# EAGLE schematic MJ818 clone - all driver - POC (EAGLE 9.4.0)
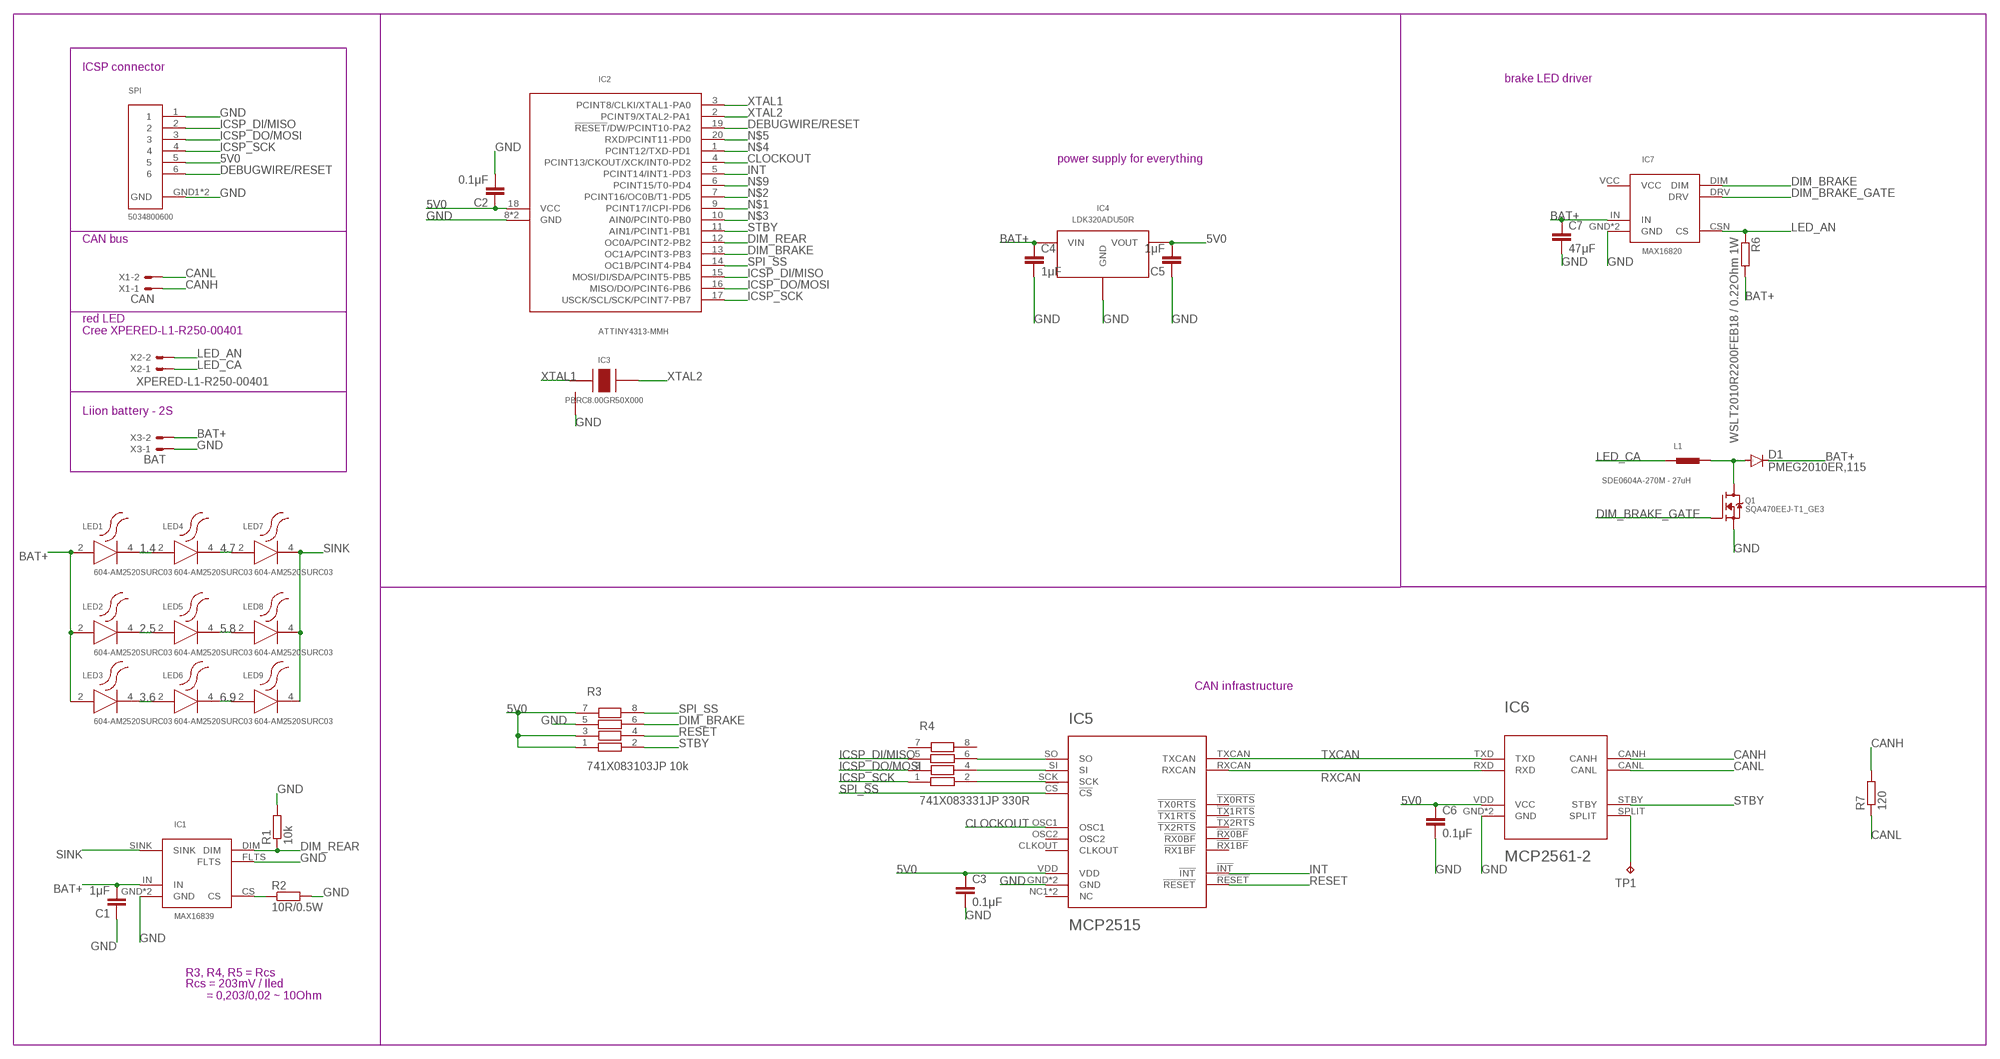
[diagram p0: schematic, sheet 1]

## Parts
C1  1μF  C-EUC0402  [C0402]
C2  0.1μF  C-EUC0402  [C0402]
C3  0.1μF  C-EUC0402  [C0402]
C4  1μF  C-EUC0402  [C0402]
C5  1μF  C-EUC0402  [C0402]
C6  0.1μF  C-EUC0402  [C0402]
C7  47μF  C-EUC0805  [C0805]
D1  PMEG2010ER,115  DIODE-SOD123  [SOD123]
IC1  MAX16839  MAX16839  [TDFN-6-EP]
IC2  ATTINY4313-MMH  ATTINY4313VQFN-20  [VQFN-20]
IC3  PBRC8.00GR50X000  PRQV  [SMT]
IC4  LDK320ADU50R  LDO  [SOT-89-D]
IC5  MCP2515  MCP2515-I-ML  [QFN20]
IC6  MCP2561-2  [DFN10]
IC7  MAX16820  [TDFN-6-EP]
L1  SDE0604A-270M - 27uH  DE0604A-778075  [SMT]
LED1  604-AM2520SURC03  1374-CLM2D-RCC-ACC-1064252  [SMD]
LED2  604-AM2520SURC03  1374-CLM2D-RCC-ACC-1064252  [SMD]
LED3  604-AM2520SURC03  1374-CLM2D-RCC-ACC-1064252  [SMD]
LED4  604-AM2520SURC03  1374-CLM2D-RCC-ACC-1064252  [SMD]
LED5  604-AM2520SURC03  1374-CLM2D-RCC-ACC-1064252  [SMD]
LED6  604-AM2520SURC03  1374-CLM2D-RCC-ACC-1064252  [SMD]
LED7  604-AM2520SURC03  1374-CLM2D-RCC-ACC-1064252  [SMD]
LED8  604-AM2520SURC03  1374-CLM2D-RCC-ACC-1064252  [SMD]
LED9  604-AM2520SURC03  1374-CLM2D-RCC-ACC-1064252  [SMD]
Q1  SQA470EEJ-T1_GE3  SIA456DJ  [SC-70-6]
R1  10k  R-EU_R0402  [R0402]
R2  10R/0.5W  R-EU_R0603  [R0603]
R3  741X083103JP 10k  741X083331JP  [0402]
R4  741X083331JP 330R  741X083331JP  [0402]
R6  WSLT2010R2200FEB18 / 0.22Ohm 1W  R-EU_R2010  [R2010]
R7  120  R-EU_R0805  [R0805]
SPI  5034800600  [SMT]
TP1  TPB2,54  [B2,54]
X1  CAN  22-23-2021  [22-23-2021]
X2  XPERED-L1-R250-00401  22-23-2021  [22-23-2021]
X3  BAT  22-23-2021  [22-23-2021]

## Nets
1.4: LED1.4(C) LED4.2(A)
2.5: LED2.4(C) LED5.2(A)
3.6: LED3.4(C) LED6.2(A)
4.7: LED4.4(C) LED7.2(A)
5.8: LED5.4(C) LED8.2(A)
5V0 [5V0CAN]: C2.1 C3.1 C5.2 C6.1 IC2.18(VCC) IC4.VOUT IC5.VDD IC6.VDD(VCC) R3.1 R3.3 R3.7 SPI.5
6.9: LED6.4(C) LED9.2(A)
BAT+ [currett-0.45]: C1.2 C4.1 C7.1 D1.C IC1.IN IC4.VIN IC7.IN LED1.2(A) LED2.2(A) LED3.2(A) R6.2 X3.2
CANH [signal]: IC6.CANH R7.2 X1.1
CANL [signal]: IC6.CANL R7.1 X1.2
CLOCKOUT [signal]: IC2.4(PCINT13/CKOUT/XCK/INT0-PD2) IC5.OSC1
CS: IC1.CS R2.1
DEBUGWIRE/RESET [signal]: IC2.19(!RESET!/DW/PCINT10-PA2) SPI.6
DIM_BRAKE [signal]: IC2.13(OC1A/PCINT3-PB3) IC7.DIM R3.6
DIM_BRAKE_DRAIN: D1.A L1.P$2 Q1.D
DIM_BRAKE_GATE [signal]: IC7.DRV Q1.G
DIM_REAR [signal]: IC1.DIM IC2.12(OC0A/PCINT2-PB2) R1.1
GND: C1.1 C2.2 C3.2 C4.2 C5.1 C6.2 C7.2 IC1.FLTS IC1.GND IC1.GND1(GND) IC2.8(GND) IC2.GND IC3.GND IC4.GND IC5.GND IC5.GND6(GND) IC6.GND IC6.VSS(GND) IC7.GND IC7.GND1(GND) Q1.S R1.2 R2.2 R3.5 SPI.1 SPI.GND1(GND) SPI.GND2(GND) X3.1
ICSP_DI/MISO [signal]: IC2.15(MOSI/DI/SDA/PCINT5-PB5) R4.5 SPI.2
ICSP_DO/MOSI [signal]: IC2.16(MISO/DO/PCINT6-PB6) R4.3 SPI.3
ICSP_SCK [signal]: IC2.17(USCK/SCL/SCK/PCINT7-PB7) R4.1 SPI.4
INT [signal]: IC2.5(PCINT14/INT1-PD3) IC5.!INT!
LED_AN [currett-0.45]: IC7.CSN(CS) R6.1 X2.2
LED_CA: L1.P$1 X2.1
N$1: IC2.9(PCINT17/ICPI-PD6)
N$2: IC2.7(PCINT16/OC0B/T1-PD5)
N$3: IC2.10(AIN0/PCINT0-PB0)
N$4: IC2.1(PCINT12/TXD-PD1)
N$5: IC2.20(RXD/PCINT11-PD0)
N$9: IC2.6(PCINT15/T0-PD4)
RESET [signal]: IC5.!RESET! R3.4
RXCAN [signal]: IC5.RXCAN IC6.RXD
SINK: IC1.SINK LED7.4(C) LED8.4(C) LED9.4(C)
SPI_MISO [signal]: IC5.SO R4.6
SPI_MOSI [signal]: IC5.SI R4.4
SPI_SCK [signal]: IC5.SCK R4.2
SPI_SS [signal]: IC2.14(OC1B/PCINT4-PB4) IC5.!CS! R3.8
SPLIT: IC6.SPLIT TP1.TP
STBY [signal]: IC2.11(AIN1/PCINT1-PB1) IC6.STBY R3.2
TXCAN [signal]: IC5.TXCAN IC6.TXD
XTAL1 [signal]: IC2.3(PCINT8/CLKI/XTAL1-PA0) IC3.XTAL1
XTAL2 [signal]: IC2.2(PCINT9/XTAL2-PA1) IC3.XTAL2
Unconnected: IC5.!RX0BF! IC5.!RX1BF! IC5.!TX0RTS! IC5.!TX1RTS! IC5.!TX2RTS! IC5.CLKOUT IC5.NC1(NC) IC5.NC2(NC) IC5.OSC2 R4.7 R4.8

## Notes on the sheet
- ICSP connector
- brake LED driver
- power supply for everything
- CAN bus
- red LED
  Cree XPERED-L1-R250-00401
- Liion battery - 2S
- CAN infrastructure
- R3, R4, R5 = Rcs
- Rcs = 203mV / Iled
         = 0,203/0,02 ~ 10Ohm

## Power pins joined to a net without a drawn wire
VCC: IC7.VCC

## Library data of the parts
C1-C7 = rcl:C-EU: CAPACITOR, European symbol; SPICEPREFIX: C
D1 = diode:DIODE-: DIODE
IC1 = MAX16839 LED Driver, constant current:MAX16839
IC2 = ATtiny4313 microcontroller:ATTINY4313; SPICEPREFIX: X
IC3 = PRQV8.00CR1510Y00L - 8MHz resonator:PRQV
IC4 = LDO SOT-89:LDO
IC5 = MCP2515-I-ML - Standalonce CAN Controller with SPI Interface:MCP2515-I-ML
IC6 = MCP2561-2 - High-Speed CAN Transceiver:MCP2561-2
IC7 = MAX16820 LED Driver, constant current:MAX16820
L1 = DE0604A-778075 - Inductor:DE0604A-778075
LED1-LED9 = 1374-CLM2D-RCC-ACC-1064252 - Red SMD LED:1374-CLM2D-RCC-ACC-1064252
Q1 = SIA456DJ-T1-GE3  N-Fet:SIA456DJ
R1 R2 R6 R7 = rcl:R-EU_: RESISTOR, European symbol; SPICEPREFIX: R
R3 R4 = 74x-1133528 Resistor Array:741X083331JP
SPI = 5034800600 FPC Connector:5034800600
TP1 = testpad:TP: Test pad
X1-X3 = con-molex:22-23-2021: .100" (2.54mm) Center Header - 2 Pin; MF: MOLEX; MPN: 22-23-2021; OC_FARNELL: 1462926; OC_NEWARK: 25C3832

## Net classes
0 GND: width 0.254 mm, drill 0.254 mm, clearance 0.127 mm
1 VCC: width 0.254 mm, drill 0.254 mm, clearance 0.127 mm
2 signal: width 0.127 mm, drill 0.254 mm, clearance 0.127 mm
3 5V0CAN: width 0.3 mm, drill 0.35 mm, clearance 0.2 mm
4 5V0_μC: width 0.25 mm, drill 0.25 mm, clearance 0.2 mm
5 currett-0.45: width 0.45 mm, drill 0.35 mm, clearance 0.2 mm